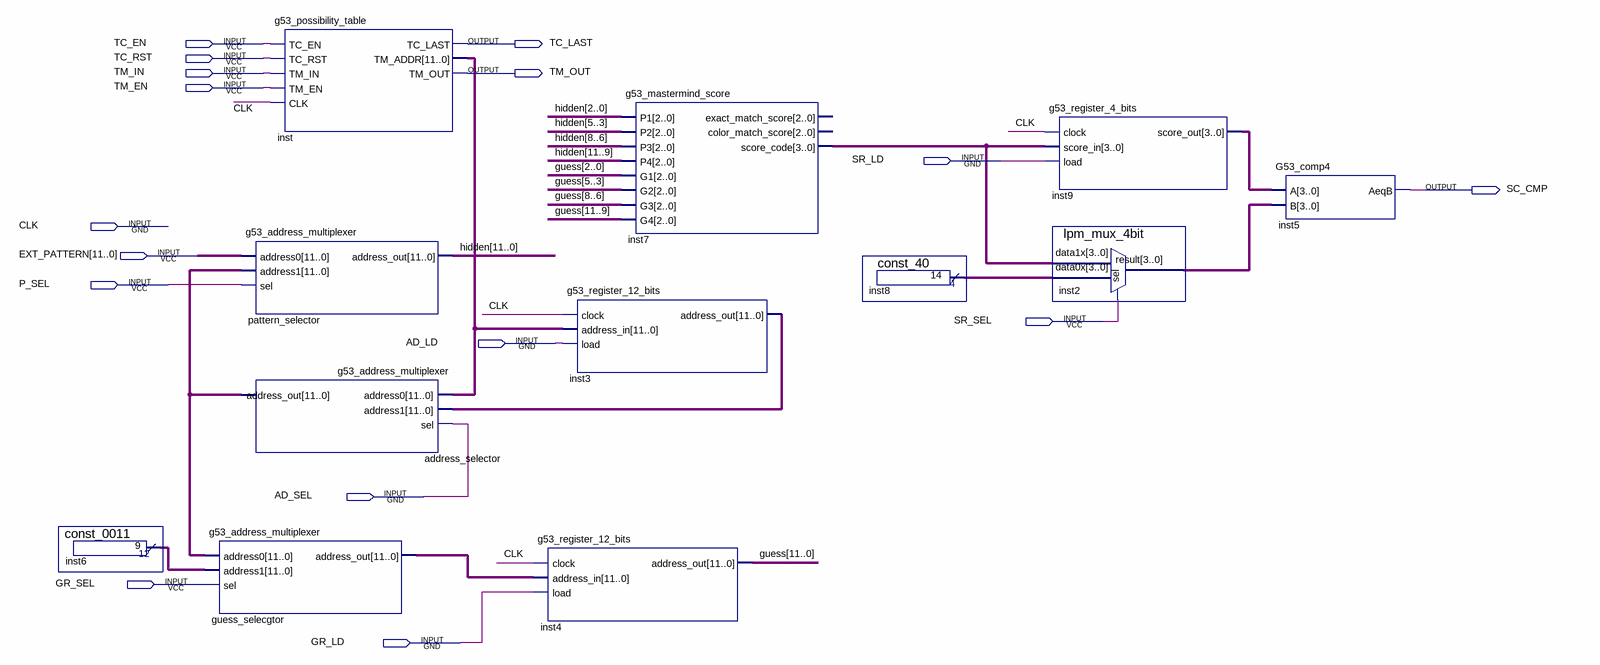
[diagram p0: schematic sheet]
// Quartus schematic g53_mastermind_datapath.bdf as structural Verilog: 12 symbols, 16 pins
module g53_mastermind_datapath (
  input  TC_EN,
  input  TC_RST,
  input  TM_IN,
  input  TM_EN,
  input  SR_LD,
  input  CLK,
  input  [11:0] EXT_PATTERN,
  input  P_SEL,
  input  SR_SEL,
  input  AD_LD,
  input  AD_SEL,
  input  GR_SEL,
  input  GR_LD,
  output TC_LAST,
  output TM_OUT,
  output SC_CMP
);

  wire [3:0] inst2_result, inst7_score_code, inst8_result, inst9_score_out;
  wire [11:0] address_selector_address_out, guess, guess_selecgtor_address_out, hidden, inst3_address_out,
       inst6_result, inst_tm_addr;

  const_0011 inst6 (.result(inst6_result));
  g53_address_multiplexer guess_selecgtor (
    .address0(address_selector_address_out), .address1(inst6_result), .sel(GR_SEL),
    .address_out(guess_selecgtor_address_out));
  g53_possibility_table inst (
    .TC_EN(TC_EN), .TC_RST(TC_RST), .TM_IN(TM_IN), .TM_EN(TM_EN), .CLK(CLK), .TC_LAST(TC_LAST),
    .TM_ADDR(inst_tm_addr), .TM_OUT(TM_OUT));
  g53_address_multiplexer pattern_selector (
    .address0(EXT_PATTERN), .address1(address_selector_address_out), .sel(P_SEL), .address_out(hidden));
  g53_address_multiplexer address_selector (
    .address0(inst_tm_addr), .address1(inst3_address_out), .sel(AD_SEL),
    .address_out(address_selector_address_out));
  g53_register_12_bits inst3 (.clock(CLK), .address_in(inst_tm_addr), .load(AD_LD), .address_out(inst3_address_out));
  g53_register_12_bits inst4 (.clock(CLK), .address_in(guess_selecgtor_address_out), .load(GR_LD), .address_out(guess));
  g53_mastermind_score inst7 (
    .P1(hidden[2:0]), .P2(hidden[5:3]), .P3(hidden[8:6]), .P4(hidden[11:9]), .G1(guess[2:0]),
    .G2(guess[5:3]), .G3(guess[8:6]), .G4(guess[11:9]), .score_code(inst7_score_code));  // open: exact_match_score, color_match_score
  const_40 inst8 (.result(inst8_result));
  g53_register_4_bits inst9 (.clock(CLK), .score_in(inst7_score_code), .load(SR_LD), .score_out(inst9_score_out));
  lpm_mux_4bit inst2 (.data1x(inst7_score_code), .data0x(inst8_result), .sel(SR_SEL), .result(inst2_result));
  G53_comp4 inst5 (.A(inst9_score_out), .B(inst2_result), .AeqB(SC_CMP));
endmodule
